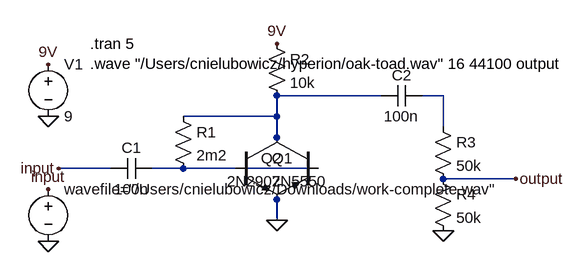
[diagram p0: schematic hyperion.asc]
hyperion.asc, the LTspice schematic file:
Version 4
SHEET 1 924 680
WIRE 608 272 448 272
WIRE 704 272 672 272
WIRE 448 304 448 272
WIRE 448 304 304 304
WIRE 704 320 704 272
WIRE 448 336 448 304
WIRE 192 384 112 384
WIRE 304 384 256 384
WIRE 384 384 304 384
WIRE 512 384 400 384
WIRE 816 400 704 400
WIRE 448 464 448 432
FLAG 448 464 0
FLAG 704 480 0
FLAG 112 384 input
FLAG 448 192 9V
FLAG 816 400 output
FLAG 96 224 9V
FLAG 96 304 0
FLAG 96 496 0
FLAG 96 416 input
SYMBOL cap 256 368 R90
WINDOW 0 0 32 VBottom 2
WINDOW 3 32 32 VTop 2
SYMATTR InstName C1
SYMATTR Value 100n
SYMBOL cap 672 256 R90
WINDOW 0 0 32 VBottom 2
WINDOW 3 32 32 VTop 2
SYMATTR InstName C2
SYMATTR Value 100n
SYMBOL res 288 288 R0
SYMATTR InstName R1
SYMATTR Value 2m2
SYMBOL res 432 176 R0
SYMATTR InstName R2
SYMATTR Value 10k
SYMBOL res 688 304 R0
SYMATTR InstName R3
SYMATTR Value 50k
SYMBOL res 688 384 R0
SYMATTR InstName R4
SYMATTR Value 50k
SYMBOL npn 384 336 R0
SYMATTR InstName Q1
SYMATTR Value 2N5550
SYMBOL pnp 512 336 M0
SYMATTR InstName Q2
SYMATTR Value 2N2907
SYMBOL voltage 96 208 R0
SYMATTR InstName V1
SYMATTR Value 9
SYMBOL voltage 96 400 R0
SYMATTR InstName wavefile="/Users/cnielubowicz/Downloads/work-complete.wav"
SYMATTR Value ""
TEXT 160 192 Left 2 !.tran 5\n.wave "/Users/cnielubowicz/hyperion/oak-toad.wav" 16 44100 output

The netlist it stands for:
* hyperion.asc
C1 N003 input 100n
C2 N002 N001 100n
R1 N001 N003 2m2
R2 9V N001 10k
R3 N002 output 50k
R4 output 0 50k
Q1 N001 N003 0 0 2N5550
Q2 N001 N004 0 0 2N2907
V1 9V 0 9
V§wavefile="/Users/cnielubowicz/Downloads/work-complete.wav" input 0
.model NPN NPN
.model PNP PNP
.lib standard.bjt
.tran 5
.wave "/Users/cnielubowicz/hyperion/oak-toad.wav" 16 44100 output
.backanno
.end